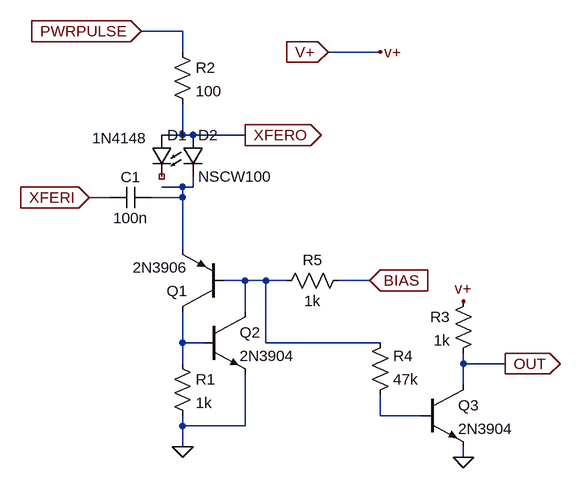
[diagram p0: schematic RingCounter1.asc]
RingCounter1.asc, the LTspice schematic file:
Version 4
SHEET 1 892 832
WIRE 288 -128 224 -128
WIRE 288 -96 288 -128
WIRE 592 -96 512 -96
WIRE 288 32 288 -16
WIRE 288 32 256 32
WIRE 304 32 288 32
WIRE 384 32 304 32
WIRE 288 112 256 112
WIRE 304 112 304 96
WIRE 304 112 288 112
WIRE 176 128 144 128
WIRE 288 128 288 112
WIRE 288 128 240 128
WIRE 288 208 288 128
WIRE 384 256 352 256
WIRE 416 256 384 256
WIRE 448 256 416 256
WIRE 576 256 528 256
WIRE 384 304 384 256
WIRE 288 352 288 304
WIRE 320 352 288 352
WIRE 416 352 416 256
WIRE 592 352 416 352
WIRE 288 384 288 352
WIRE 720 384 720 368
WIRE 784 384 720 384
WIRE 720 416 720 384
WIRE 592 464 592 432
WIRE 656 464 592 464
WIRE 288 480 288 464
WIRE 384 480 384 400
WIRE 384 480 288 480
WIRE 288 512 288 480
WIRE 720 528 720 512
FLAG 288 512 0
FLAG 720 528 0
FLAG 720 288 v+
FLAG 784 384 OUT
IOPIN 784 384 Out
FLAG 576 256 BIAS
IOPIN 576 256 In
FLAG 144 128 XFERI
IOPIN 144 128 In
FLAG 384 32 XFERO
IOPIN 384 32 Out
FLAG 224 -128 PWRPULSE
IOPIN 224 -128 In
FLAG 512 -96 V+
IOPIN 512 -96 In
FLAG 592 -96 v+
SYMBOL pnp 352 304 R180
SYMATTR InstName Q1
SYMATTR Value 2N3906
SYMBOL npn 320 304 R0
SYMATTR InstName Q2
SYMATTR Value 2N3904
SYMBOL res 272 368 R0
SYMATTR InstName R1
SYMATTR Value 1k
SYMBOL res 272 -112 R0
SYMATTR InstName R2
SYMATTR Value 100
SYMBOL cap 240 112 R90
WINDOW 0 0 32 VBottom 2
WINDOW 3 32 32 VTop 2
SYMATTR InstName C1
SYMATTR Value 100n
SYMBOL diode 240 32 R0
WINDOW 3 -91 5 Left 2
SYMATTR InstName D1
SYMATTR Value 1N4148
SYMBOL npn 656 416 R0
SYMATTR InstName Q3
SYMATTR Value 2N3904
SYMBOL res 736 272 M0
SYMATTR InstName R3
SYMATTR Value 1k
SYMBOL res 576 448 M180
WINDOW 0 36 76 Left 2
WINDOW 3 36 40 Left 2
SYMATTR InstName R4
SYMATTR Value 47k
SYMBOL res 544 240 R90
WINDOW 0 0 56 VBottom 2
WINDOW 3 32 56 VTop 2
SYMATTR InstName R5
SYMATTR Value 1k
SYMBOL LED 288 32 R0
SYMATTR InstName D2
SYMATTR Value NSCW100

The netlist it stands for:
* RingCounter1.asc
Q1 N003 N002 N001 0 2N3906
Q2 N002 N003 0 0 2N3904
R1 N003 0 1k
R2 PWRPULSE XFERO 100
C1 N001 XFERI 100n
D1 XFERO NC_01 1N4148
Q3 OUT N004 0 0 2N3904
R3 v+ OUT 1k
R4 N004 N002 47k
R5 BIAS N002 1k
D2 XFERO N001 NSCW100
.model D D
.lib standard.dio
.model NPN NPN
.model PNP PNP
.lib standard.bjt
.backanno
.end